# EAGLE schematic water_level (EAGLE 7.3.0)
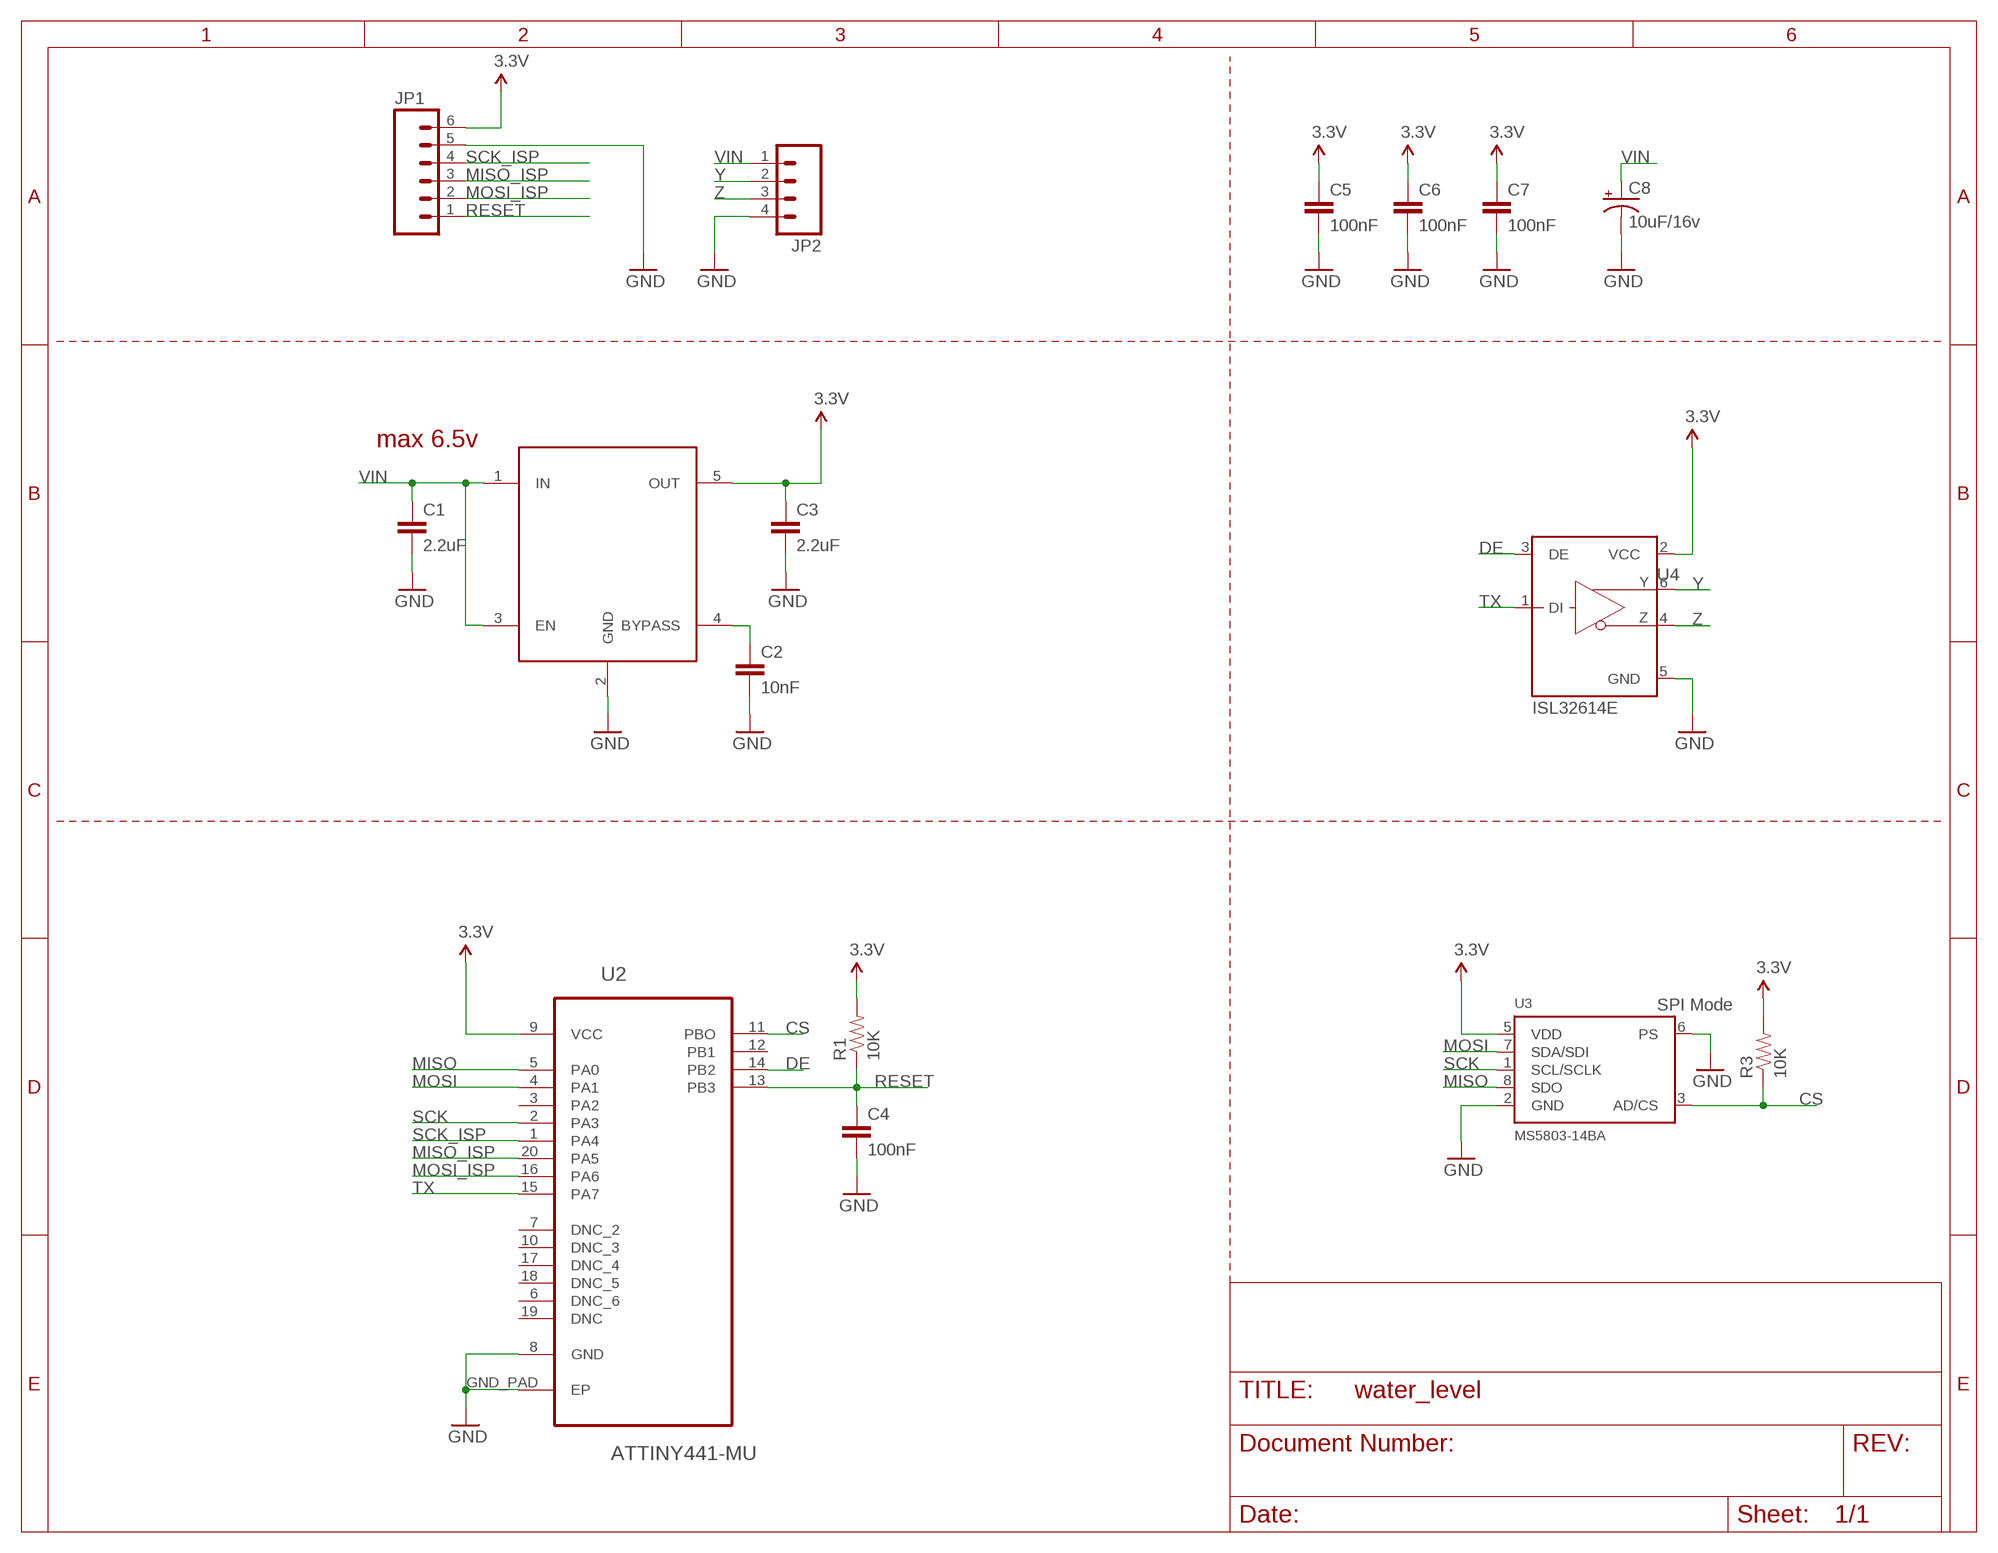
[diagram p0: schematic, sheet 1]

## Parts
C1  2.2uF  CAP0402-CAP  [0402-CAP]
C2  10nF  CAP0402-CAP  [0402-CAP]
C3  2.2uF  CAP0402-CAP  [0402-CAP]
C4  100nF  CAP0402-CAP  [0402-CAP]
C5  100nF  CAP0402-CAP  [0402-CAP]
C6  100nF  CAP0402-CAP  [0402-CAP]
C7  100nF  CAP0402-CAP  [0402-CAP]
C8  10uF/16v  10UF-16V-10%(TANT)  [EIA3216]
JP1  M06SILK_FEMALE_PTH  [1X06]
JP2  M04PTH  [1X04]
R1  10K  RESISTOR0402  [0402-RES]
R3  10K  RESISTOR0402  [0402-RES]
U1  LP3985  [SOT23-5]
U2  ATTINY441-MU  [QFN50P400X400X80-21N]
U3  MS5803-14BA  [MS5803]
U4  ISL32614E  [SOT23-6]

## Nets
3.3V: C3.1 C5.1 C6.1 C7.1 JP1.6 R1.2 R3.2 U1.5(OUT) U2.9(VCC) U3.5(VDD) U4.2(VCC)
CS: R3.1 U2.11(PBO) U3.3(AD/CS)
DE: U2.14(PB2) U4.3(DE)
GND: C1.2 C2.2 C3.2 C4.2 C5.2 C6.2 C7.2 C8.C(-) JP1.5 JP2.4 U1.2(GND) U2.8(GND) U2.GND_PAD(EP) U3.2(GND) U3.6(PS) U4.5(GND)
MISO: U2.5(PA0) U3.8(SDO)
MISO_ISP: JP1.3 U2.20(PA5)
MOSI: U2.4(PA1) U3.7(SDA/SDI)
MOSI_ISP: JP1.2 U2.16(PA6)
N$5: C2.1 U1.4(BYPASS)
RESET: C4.1 JP1.1 R1.1 U2.13(PB3)
SCK: U2.2(PA3) U3.1(SCL/SCLK)
SCK_ISP: JP1.4 U2.1(PA4)
TX: U2.15(PA7) U4.1(DI)
VIN: C1.1 C8.A(+) JP2.1 U1.1(IN) U1.3(EN)
Y: JP2.2 U4.6(Y)
Z: JP2.3 U4.4(Z)
Unconnected: U2.3(PA2) U2.6(DNC_6) U2.7(DNC_2) U2.10(DNC_3) U2.12(PB1) U2.17(DNC_4) U2.18(DNC_5) U2.19(DNC)

## Notes on the sheet
- max 6.5v
- SPI Mode

## Library data of the parts
C1-C7 = SparkFun-Capacitors:CAP: Capacitor Standard 0603 ceramic capacitor, and 0.1" leaded capacitor.
C8 = SparkFun-Capacitors:10UF-16V-10%(TANT): CAP-00811 1206/EIA-3216 Tantalum capacitor; PROD_ID: CAP-00811; VALUE: 10uF
JP1 = SparkFun-Connectors:M06: Header 6 Standard 6-pin 0.1" header. Use with straight break away headers (SKU : PRT-00116), right angle break away headers (PRT-00553), swiss pins (PRT-00743), machine pins (PRT-00117), and female headers (PRT-00115). Molex polarized connector foot print use with SKU : PRT-08094 with associated crimp pins and housings. NOTES ON THE VARIANTS LOCK and LOCK_LONGPADS... This footprint was designed to help hold the alignment of a through-hole component (i.e. 6-pin header) while soldering it into place. You may notice that each hole has been shifted either up or down by 0.005 of an inch from it's more standard position (which is a perfectly straight line). This slight alteration caused the pins (the squares in the middle) to touch the edges of the holes. Because they are alternating, it causes a "brace" to hold the component in place. 0.005 has proven to be the perfect amount of "off-center" position when using our standard breakaway headers. Although looks a little odd when you look at the bare footprint, once you have a header in there, the alteration is very hard to notice. Also,if you push a header all the way into place, it is covered up entirely on the bottom side. This idea of altering the position of holes to aid alignment will be further integrated into the Sparkfun Library for other footprints. It can help hold any component with 3 or more connection pins.; PROD_ID: CONN-08437
JP2 = SparkFun-Connectors:M04: Header 4 Standard 4-pin 0.1" header. Use with straight break away headers (SKU : PRT-00116), right angle break away headers (PRT-00553), swiss pins (PRT-00743), machine pins (PRT-00117), and female headers (PRT-00115). Molex polarized connector foot print use with SKU : PRT-08231 with associated crimp pins and housings. 1MM SMD Version SKU: PRT-10208
R1 R3 = SparkFun-Resistors:RESISTOR: Resistor Basic schematic elements and footprints for 0603, 1206, and PTH resistors.
U1 = lp3985:LP3985
U2 = Atmel-ATTINY441-MU:ATTINY441-MU: Microcontroller with In-System Programmable Flash; MPN: ATTINY441-MU; OC_FARNELL: 1748545; OC_NEWARK: 26R5651; PACKAGE: QFN-20; SUPPLIER: Atmel
U3 = MS5803:MS5803-14BA; PROD_ID: IC-12111
U4 = ISL32614E:ISL32614E